# EAGLE design lm2576_acs720_hc_020k (EAGLE 9.6.1)
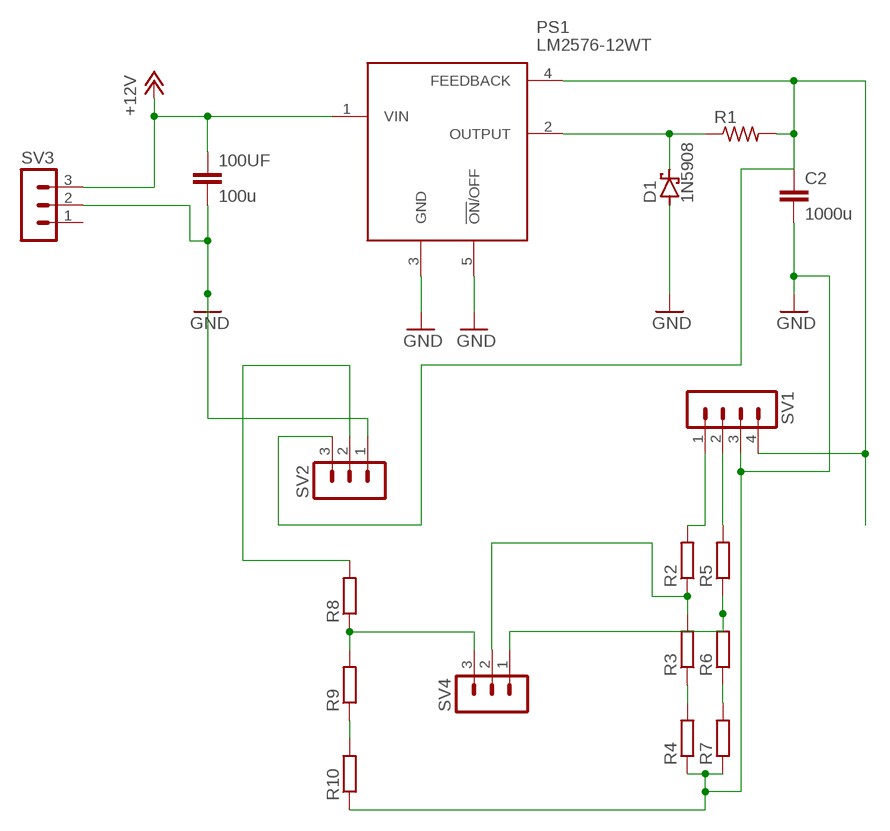
[diagram p0: schematic, sheet 1]

## Parts
100UF  100u  C5/5  [C5B5]
C2  1000u  C5/5  [C5B5]
D1  1N5908  [C4111-15]
PS1  LM2576-12WT  [TO170P470X1016X1900-5P]
R1  R-US_VTA55  [VTA55]
R2  R-EU_0207/12  [0207/12]
R3  R-EU_0207/12  [0207/12]
R4  R-EU_0207/12  [0207/12]
R5  R-EU_0207/12  [0207/12]
R6  R-EU_0207/12  [0207/12]
R7  R-EU_0207/12  [0207/12]
R8  R-EU_0207/12  [0207/12]
R9  R-EU_0207/12  [0207/12]
R10  R-EU_0207/12  [0207/12]
SV1  MA04-1  [MA04-1]
SV2  MA03-1  [MA03-1]
SV3  MA03-1  [MA03-1]
SV4  MA03-1  [MA03-1]

## Nets
+5V: C2.1 PS1.4(FEEDBACK) R1.2 SV1.4 SV2.3
+12V: 100UF.1 PS1.1(VIN) SV3.3
GND: 100UF.2 C2.2 D1.A PS1.3(GND) PS1.5(!ON!/OFF) R4.1 R7.1 R10.1 SV1.3 SV2.1 SV3.2
N$1: R8.1 R9.2 SV4.3
N$2: D1.C PS1.2(OUTPUT) R1.1
N$3: R5.1 R6.2 SV4.1
N$4: R3.1 R4.2
N$5: R9.1 R10.2
N$6: R6.1 R7.2
N$7: R8.2 SV2.2
N$8: R2.1 R3.2 SV4.2
N$9: R2.2 SV1.1
N$10: R5.2 SV1.2
Unconnected: SV3.1

## Library data of the parts
100UF C2 = capacitor-wima:C: CAPACITOR naming: grid - package width
D1 = diode:1N5908: DIODE schottky
PS1 = SamacSys_Parts:LM2576-12WT: MICROCHIP - LM2576-12WT - DC/DC CONV, BUCK, 52KHZ, TO-220-5 Source: Datasheet <http://ww1.microchip.com/downloads/en/DeviceDoc/lm2576.pdf>; DESCRIPTION: MICROCHIP - LM2576-12WT - DC/DC CONV, BUCK, 52KHZ, TO-220-5; HEIGHT: 4.7mm; MANUFACTURER_NAME: Microchip; MANUFACTURER_PART_NUMBER: LM2576-12WT; MOUSER_PART_NUMBER: 998-LM2576-12WT; MOUSER_PRICE-STOCK: https://www.mouser.com/Search/Refine.aspx?Keyword=998-LM2576-12WT; RS_PART_NUMBER: 1771883; RS_PRICE-STOCK: http://uk.rs-online.com/web/p/products/1771883
R1 = rcl:R-US_: RESISTOR, American symbol; SPICEPREFIX: R
R2-R10 = rcl:R-EU_: RESISTOR, European symbol; SPICEPREFIX: R
SV1 = con-lstb:MA04-1: PIN HEADER; OC_FARNELL: unknown; OC_NEWARK: unknown
SV2-SV4 = con-lstb:MA03-1: PIN HEADER; OC_FARNELL: unknown; OC_NEWARK: unknown

## Board
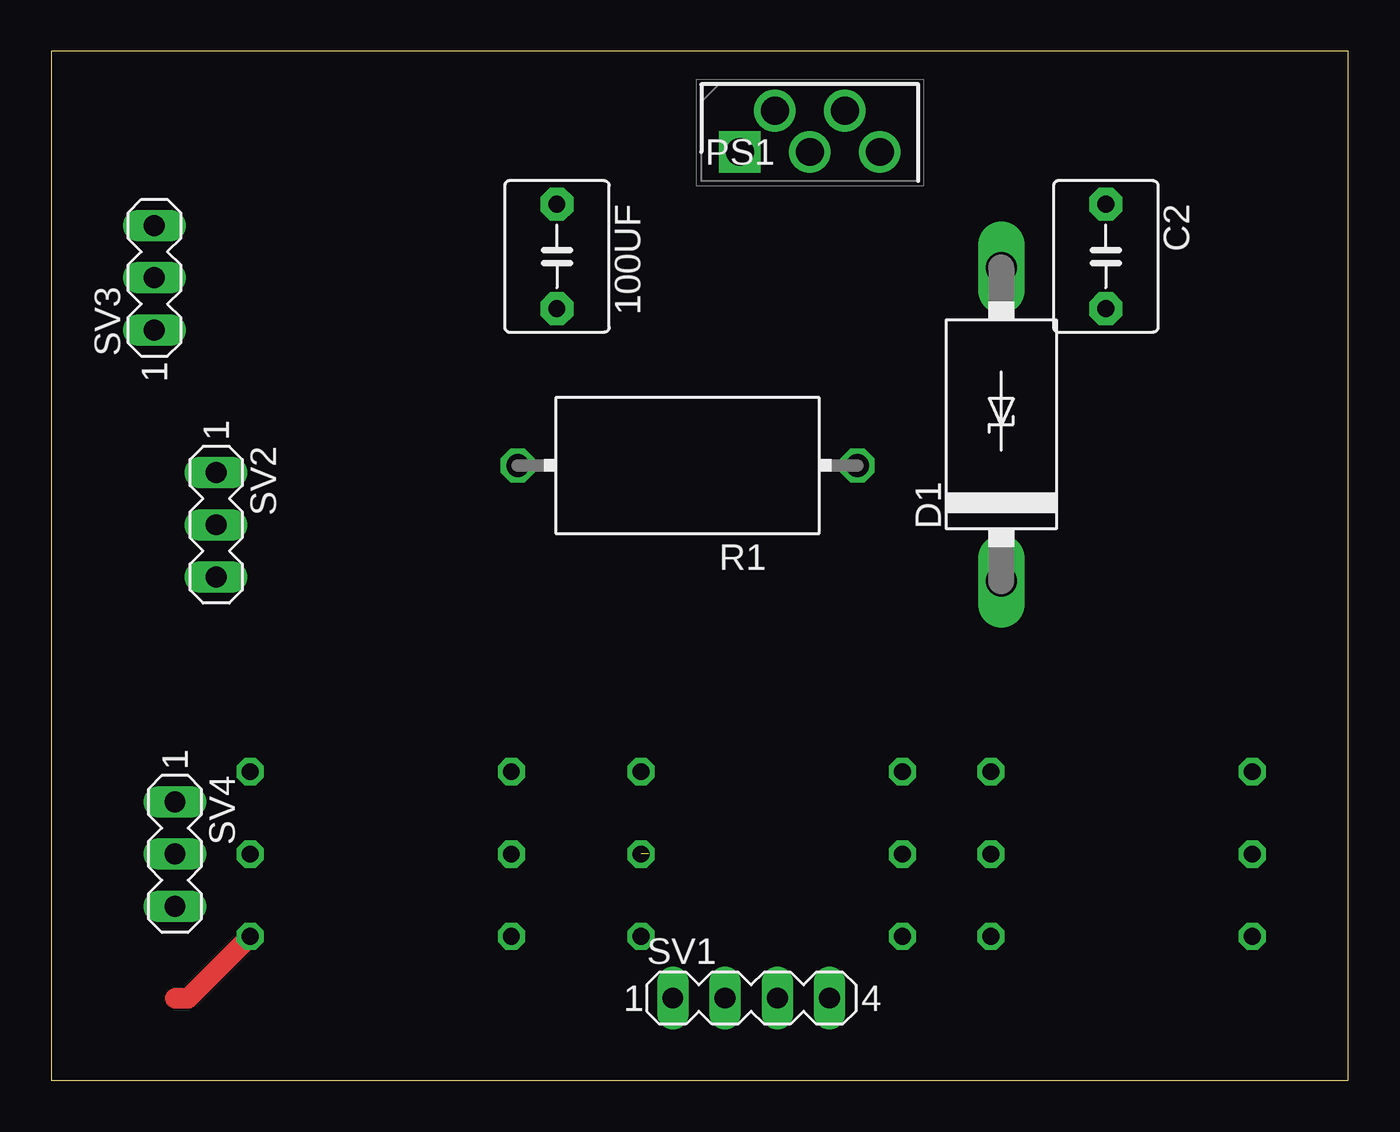
[diagram p1: board, top side]
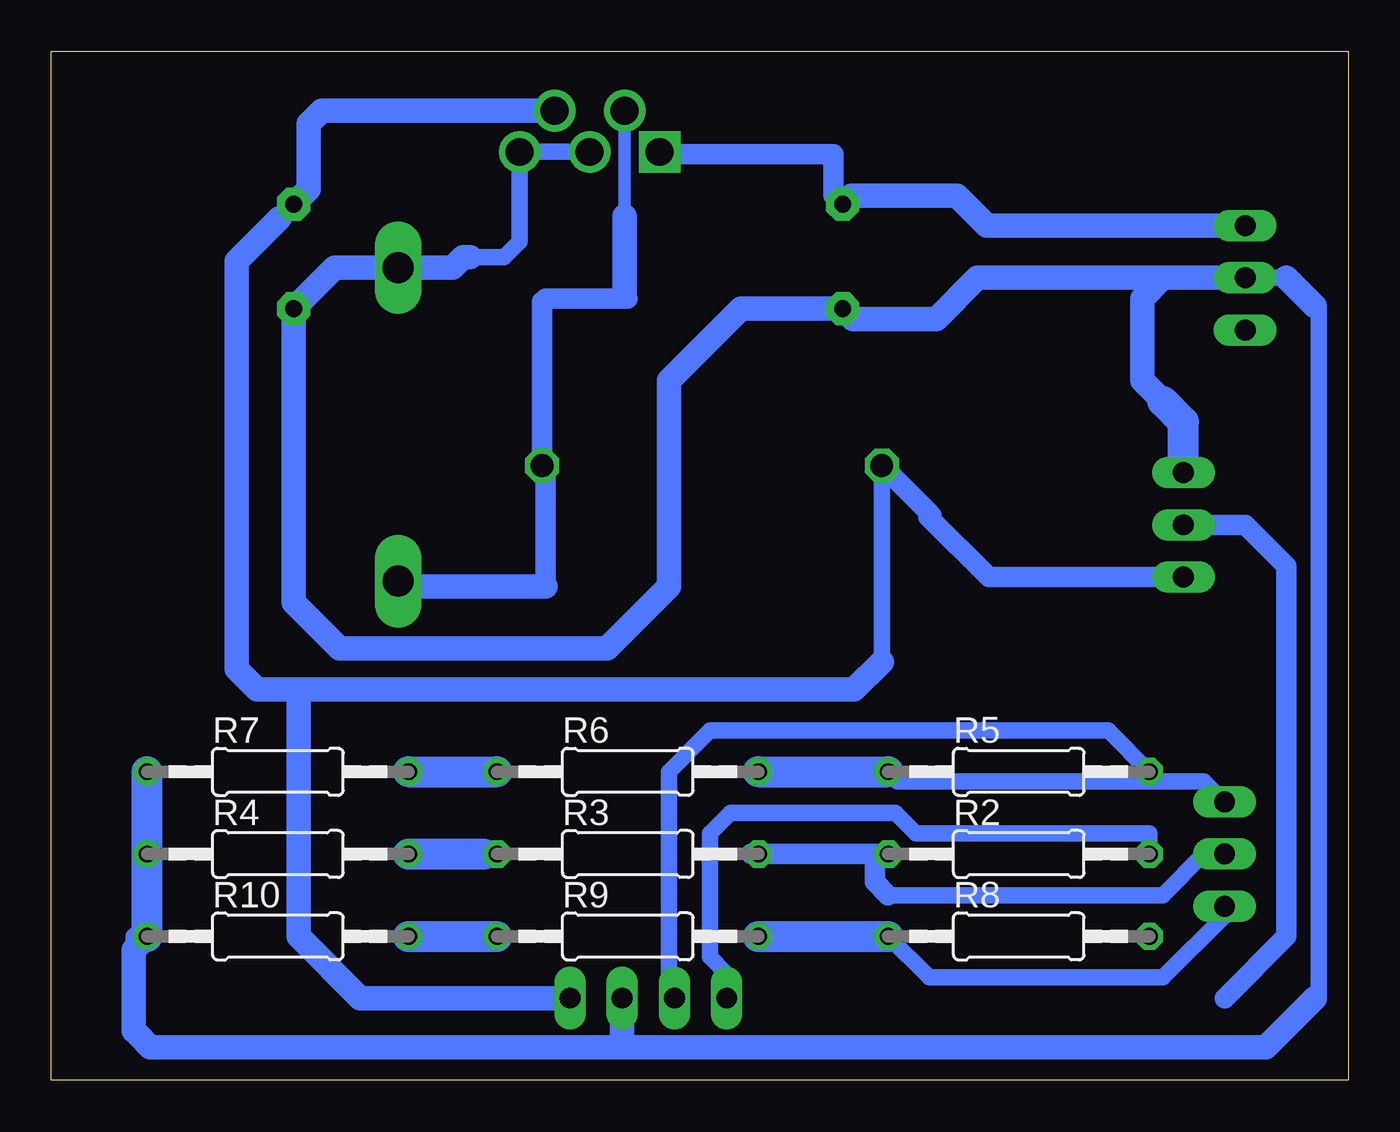
[diagram p2: board, bottom side, seen from below]

Size 63 x 50 mm. Coordinates in mm from the lower left corner, seen from the top.
Outline: 0,0 63,0 63,50 0,50 0,0
Copper layers (1*16): Top 0.035mm / dielectric 1.5mm / Bottom 0.035mm
Design rules "default": minimum track width 6mil, minimum drill 0.35mm, track to track 6mil, track to pad 6mil, pad to pad 6mil, via to via 6mil, smd to smd 6mil, copper to edge 40mil, drill to drill 6mil, minimum pad ring 10mil, minimum via ring 8mil, stop-mask expansion 4mil, vias tented up to drill 0mil, thermal gap 10mil

### Footprints (pad centres in the part's own frame; a part is rotated, then mirrored left to right if it is on the bottom)
C5B5 = drill 0.813 pad 1.6 octagon: 1 -2.54,0; 2 2.54,0
C4111-15 = drill 1.499 long: A 7.62,0; C -7.62,0
TO170P470X1016X1900-5P = drill 1.35 pad 2.025 square: 1 0,0 | drill 1.35 pad 2.025: 2 1.7,2; 3 3.4,0; 4 5.1,2; 5 6.8,0
VTA55 = drill 1.1 octagon: 1 -8.255,0; 2 8.255,0
0207/12 = drill 0.813 octagon: 1 -6.35,0; 2 6.35,0
MA04-1 = drill 1.016 long: 1 -3.81,0; 2 -1.27,0; 3 1.27,0; 4 3.81,0
MA03-1 = drill 1.016 long: 1 -2.54,0; 2 0,0; 3 2.54,0

### Placement (x,y rotation side)
100UF  24.56,40.04 270 top
C2  51.23,40.04 270 top
D1  46.15,31.88 90 top
PS1  33.45,45.12 0 top
R1  30.91,29.88 180 top
R2  16,11 0 bottom
R3  35,11 0 bottom
R4  52,11 0 bottom
R5  16,15 0 bottom
R6  35,15 0 bottom
R7  52,15 0 bottom
R8  16,7 0 bottom
R9  35,7 0 bottom
R10  52,7 0 bottom
SV1  34,4 0 top
SV2  8,27 270 top
SV3  5,39 90 top
SV4  6,11 270 top

### Tracks (layer width: path | path; a pad name or v marks a point on that pad's centre or on a via)
+5V
  Bottom 0.8: 51.91,41.91 C2.1 | R1.2 22.66,20.34
  Bottom 1: 20.23,27.46 20.39,27.61 | 20.39,27.61 R1.2 | SV2.3 17.46,24.46 20.39,27.39 20.39,27.61
  Bottom 1.2: 22.66,20.34 24,19 51,19 | 51,19 53,19 54,20 54,39.81 51.91,41.91 | 51,19 51,7 48,4 SV1.4 | C2.1 50.5,43.31 50.5,46.5 49.88,47.12 PS1.4
+12V
  Bottom 1: PS1.1 33.33,45 25,45 25,43.02 100UF.1
  Bottom 1.2: SV3.3 17.54,41.54 19,43 24.14,43 100UF.1
GND
  Bottom 0.8: 42.65,40 41,40 40.25,40.75 PS1.5 PS1.3 | SV3.2 3,39 1.42,37.42 1.42,4 4,1.42 35,1.42 | 35,1.42 35.27,1.69 SV1.3 | R7.1 R4.1 58.35,7.65 59,7 59,2.42 58.79,2.21 58,1.42 35,1.42
  Bottom 1.2: SV3.2 9,39 | 9,39 18,39 20,37 24.06,37 100UF.2 29.5,37.5 33,34 33,24 36,21 49,21 51.23,23.23 C2.2 49.23,39.5 D1.A 43.5,39.5 43,40 42.65,40 | 9,33 10,34 10,38 9,39 | 3,39 1.62,37.62 | 1.62,4 4,1.62 35,1.62 | 35,1.62 35.27,1.89 SV1.3 | R10.1 59,6.35 59,2.42 | 58.79,2.21 58.2,1.62 35,1.62
  Bottom 1.5: R10.1 R7.1 | SV2.1 8,32 9,33
N$1
  Bottom 0.8: R8.1 20.35,5 9,5 6,8 SV4.3
  Bottom 1.5: R9.2 R8.1
N$2
  Bottom 0.6: 35.15,42 PS1.2
  Bottom 0.8: 35,38 35.15,38.15
  Bottom 1: 39,24 39,29.72 R1.1 39.16,37.84 39,38 35,38
  Bottom 1.2: 39,24 45.89,24 D1.C | 35.15,38.15 35.15,42
N$3
  Bottom 0.8: SV4.1 7,14.54 21.89,14.54 R5.1
  Bottom 1.5: R6.2 R5.1
N$4
  Bottom 0.8: 42,11 R3.1
  Bottom 1.5: R4.2 42,11
N$5
  Bottom 1.5: R10.2 R9.1
N$6
  Bottom 1.5: R7.2 R6.1
N$7  (1 unrouted)
  Top 1: R8.2 6.65,4 6,4
  Bottom 1: SV2.2 5,27 3,25 3,7 6,4
N$8  (1 unrouted)
  Bottom 0.8: SV4.2 7,11 9,9 22.35,9
  Bottom 1: 22.35,9 23,9.65 23,11 | 23,11 R2.1 | 23,11 29,11
N$9
  Bottom 0.8: SV1.1 30.19,5.19 31,6 31,12 30,13 22,13 21,12 9.65,12 R2.2
N$10
  Bottom 0.8: SV1.2 33,4.27 33,15 31,17 11.65,17 R5.2